# Altium schematic sheet Shundown_Mechanism.SchDoc
size A4
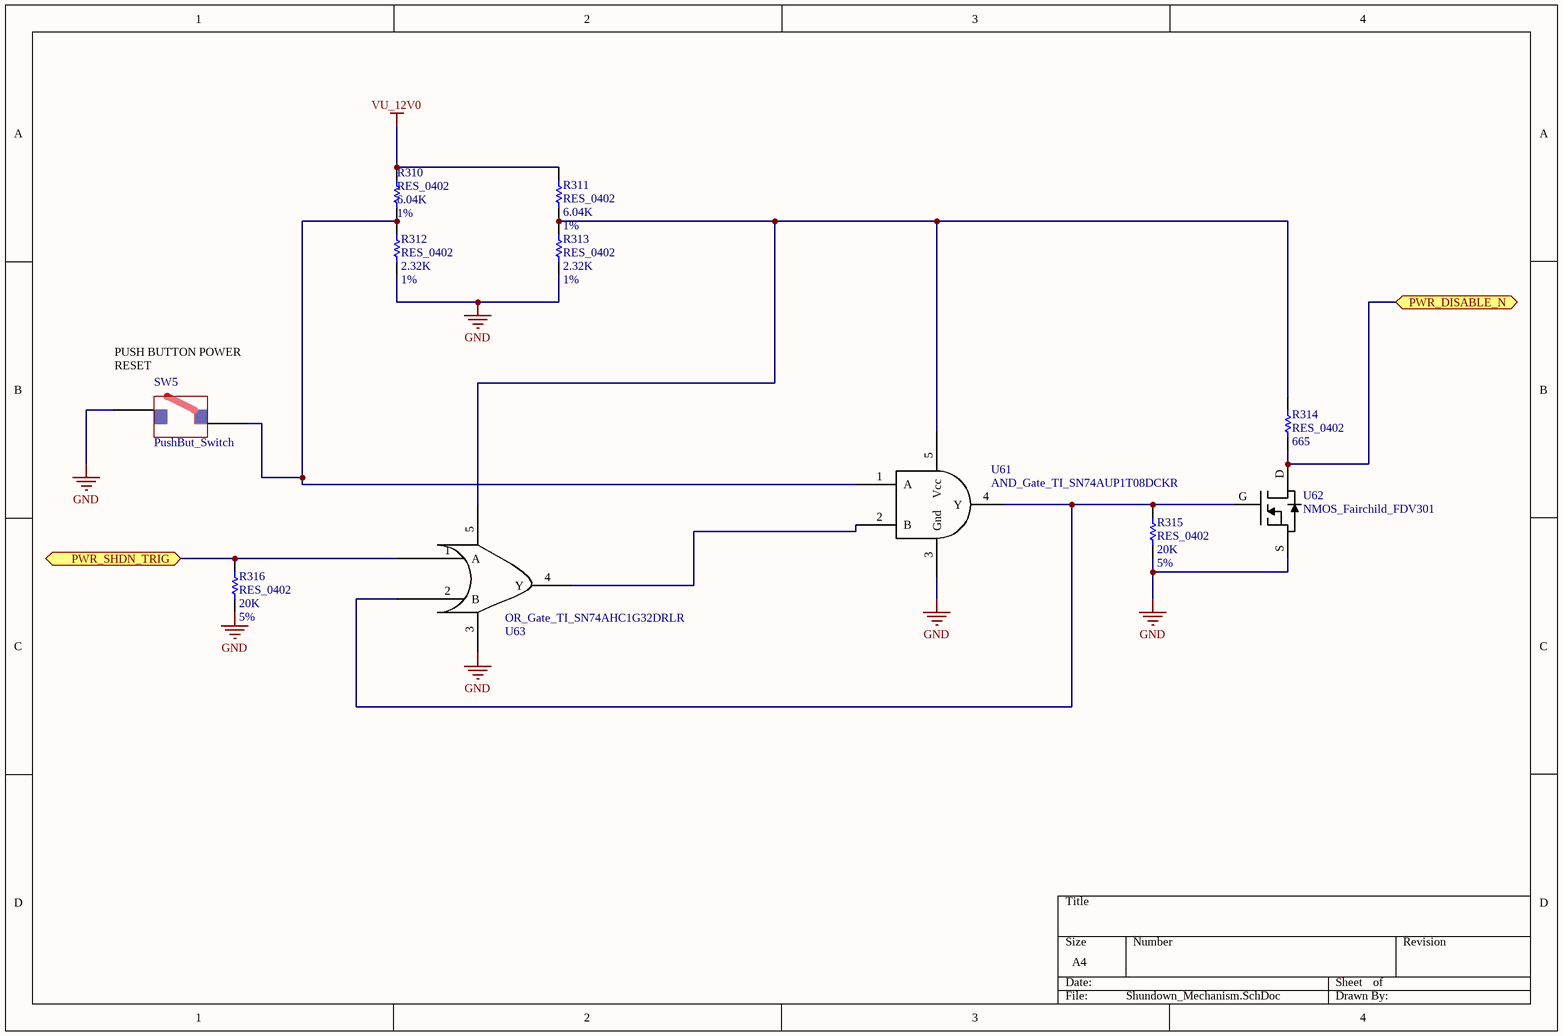
[diagram p0: Shundown_Mechanism.SchDoc]

## Parts
R310  RES_0402  value 6.04K  Tolerance: 1%  [RESC0402(1005)_N]
R311  RES_0402  value 6.04K  Tolerance: 1%  [RESC0402(1005)_N]
R312  RES_0402  value 2.32K  Tolerance: 1%  [RESC0402(1005)_N]
R313  RES_0402  value 2.32K  Tolerance: 1%  [RESC0402(1005)_N]
R314  RES_0402  value 665  [RESC0402(1005)_N]
R315  RES_0402  value 20K  Tolerance: 5%  [RESC0402(1005)_N]
R316  RES_0402  value 20K  Tolerance: 5%  [RESC0402(1005)_N]
SW5  PushBut_Switch  [PushButtonSwitch_CnK_1.14002.1110000]
U61  AND_Gate_TI_SN74AUP1T08DCKR  [AND_Gate_TI_SN74AUP1T08DCKR_SC70-5]
U62  NMOS_Fairchild_FDV301  [NMOS_Fairchild_FDV301_SOT23-3]
U63  OR_Gate_TI_SN74AHC1G32DRLR  [OR_Gate_TI_SN74AHC1G32DRLR_DRL-5]

## Ports
PWR_DISABLE_N (bidir), PWR_SHDN_TRIG

## Nets
GND: R312.1 R313.1 R315.1 R316.1 SW5.3 U61.3(Gnd) U62.S U63.3
VU_12V0: R310.2 R311.2
PWR_DISABLE_N: R314.1 U62.D ; port PWR_DISABLE_N
PWR_SHDN_TRIG: R316.2 U63.1(A) ; port PWR_SHDN_TRIG
NetR310_1: R310.1 R312.2 SW5.4 U61.1(A)
NetR311_1: R311.1 R313.2 R314.2 U61.5(Vcc) U63.5
NetR315_2: R315.2 U61.4(Y) U62.G U63.2(B)
NetU61_2: U61.2(B) U63.4(Y)

## Notes on the sheet
- (near SW5) PUSH BUTTON POWER RESET

## Library data of the parts
R310 R311 = ERJ-2RKF6041X: RES 6.04K OHM 1/10W 1% 0402 SMD; Manufacturer: Panasonic Electronic Components; Part Number: ERJ-2RKF6041X
R312 R313 = ERJ-2RKF2321X: 2.32K ohm, 1% 1/16W, 0402; Manufacturer: Panasonic - ECG; Part Number: ERJ-2RKF2321X
R314 = ERJ-2RKF6650X: RES 665 OHM 1/10W 1% 0402 SMD; Manufacturer: Panasonic Electronic Components; Tolerance: *; Part Number: ERJ-2RKF6650X; Footprint Ref: RESC0402(1005)_N; Library Ref: RES_0402
R315 R316 = RES_0402: 20K ohm, 5%, 1/16W, 0402; Part Number: ERJ-2GEJ203X; Manufacturer: Panasonic - ECG; Library Ref: RES_0402; Footprint Ref: RESC0402(1005)_N
SW5 = 1.14002.1110000: SWITCH PUSH SPST-NO 0.1A 35V; Manufacturer: C&K Components; Part Number: 1.14002.1110000
U61 = SN74AUP1T08DCKR: IC GATE POS-AND SLG 2INP SC70-5; Manufacturer: Texas Instruments; Part Number: SN74AUP1T08DCKR
U62 = FDV301N: MOSFET N-CH 25V 220MA SOT-23; Manufacturer: Fairchild Semiconductor; Part Number: FDV301N; Footprint Ref: NMOS_Fairchild_FDV301_SOT23-3; Library Ref: NMOS_Fairchild_FDV301
U63 = SN74AHC1G32DRLR: IC SNGL 2-IN POS-OR GATE SOT-5; Manufacturer: Texas Instruments; Part Number: SN74AHC1G32DRLR